# EAGLE design rapidshark-main-breakout-top-mk-1.0 (EAGLE 6.5.0)
AUTHOR: sean@yak.net
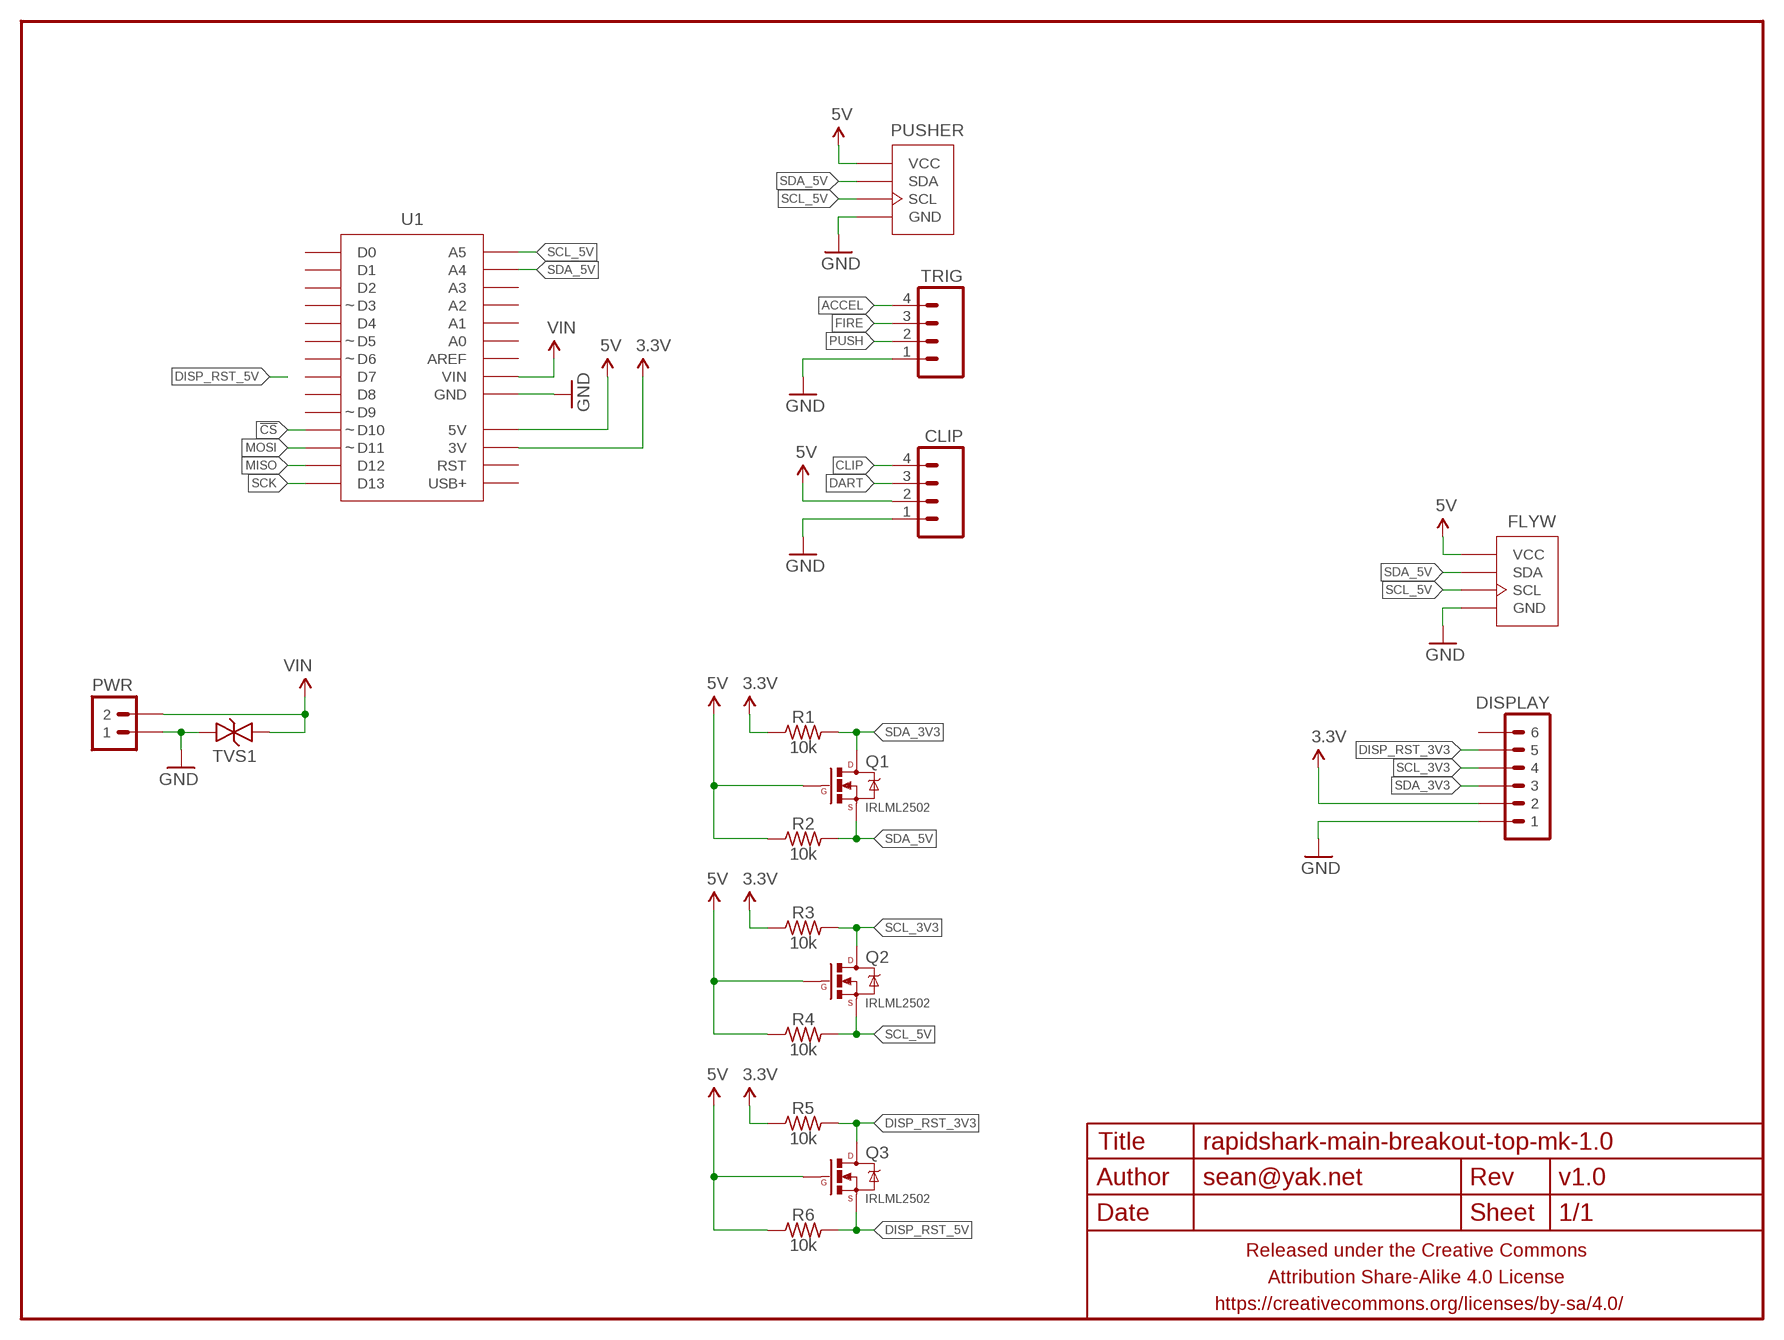
[diagram p0: schematic, sheet 1]

## Parts
CLIP  M04JST-PTH-VERT  [JST-4-PH-VERT-PTH]
DISPLAY  M06JST-PH-PTH-VERT  [JST-6-PH-VERT-PTH]
FLYW  M04-I2CJST-4-PH-VERT-NS  [JST-4-PH-VERT-PTH]
FRAME1  FRAME-LETTERNO_PACKAGE  [DUMMY]
PUSHER  M04-I2CJST-4-PH-VERT-NS  [JST-4-PH-VERT-PTH]
PWR  M02PTH-CENTERED-R+  [1X02-CENTER-R+]
Q1  IRLML2502  MOSFET-NCHANNELIRLML2502  [SOT23]
Q2  IRLML2502  MOSFET-NCHANNELIRLML2502  [SOT23]
Q3  IRLML2502  MOSFET-NCHANNELIRLML2502  [SOT23]
R1  10k  RESISTORR0603  [R0603]
R2  10k  RESISTORR0603  [R0603]
R3  10k  RESISTORR0603  [R0603]
R4  10k  RESISTORR0603  [R0603]
R5  10k  RESISTORR0603  [R0603]
R6  10k  RESISTORR0603  [R0603]
TRIG  M04JST-PTH-VERT  [JST-4-PH-VERT-PTH]
TVS1  TVSSMA  [SMA-DIODE-TVS-BIDIR]
U1  ADAFRUIT_METRO_MININOSILK-ABMBI  [ADAFRUIT_METRO_MINI_FLIPPED]

## Nets
3.3V: DISPLAY.2 R1.1 R3.1 R5.1 U1.17(3V)
5V: CLIP.2 FLYW.2(VCC) PUSHER.2(VCC) Q1.1(G) Q2.1(G) Q3.1(G) R2.1 R4.1 R6.1 U1.18(5V)
!CS: U1.11(D10)
ACCEL: TRIG.4
CLIP: CLIP.4
DART: CLIP.3
DISP_RST_3V3: DISPLAY.5 Q3.3(D) R5.2
DISP_RST_5V: Q3.2(S) R6.2
FIRE: TRIG.3
GND: CLIP.1 DISPLAY.1 FLYW.1(GND) PUSHER.1(GND) PWR.1 TRIG.1 TVS1.1 U1.19(GND) U1.20(GND)
MISO: U1.13(D12)
MOSI: U1.12(D11)
PUSH: TRIG.2
SCK: U1.14(D13)
SCL_3V3: DISPLAY.4 Q2.3(D) R3.2
SCL_5V: FLYW.4(SCL) PUSHER.4(SCL) Q2.2(S) R4.2 U1.28(A5)
SDA_3V3: DISPLAY.3 Q1.3(D) R1.2
SDA_5V: FLYW.3(SDA) PUSHER.3(SDA) Q1.2(S) R2.2 U1.27(A4)
VIN: PWR.2 TVS1.2 U1.21(VIN)
Unconnected: DISPLAY.6 U1.1(D0) U1.2(D1) U1.3(D2) U1.4(D3) U1.5(D4) U1.6(D5) U1.7(D6) U1.8(D7) U1.9(D8) U1.10(D9) U1.15(USB+) U1.16(RST) U1.22(AREF) U1.23(A0) U1.24(A1) U1.25(A2) U1.26(A3)

## Library data of the parts
CLIP TRIG = A_butts:M04: Header 4 Standard 4-pin 0.1" header. Use with straight break away headers (SKU : PRT-00116), right angle break away headers (PRT-00553), swiss pins (PRT-00743), machine pins (PRT-00117), and female headers (PRT-00115). Molex polarized connector foot print use with SKU : PRT-08231 with associated crimp pins and housings. 1MM SMD Version SKU: PRT-10208
DISPLAY = A_butts:M06: Header 6 Standard 6-pin 0.1" header. Use with straight break away headers (SKU : PRT-00116), right angle break away headers (PRT-00553), swiss pins (PRT-00743), machine pins (PRT-00117), and female headers (PRT-00115). Molex polarized connector foot print use with SKU : PRT-08094 with associated crimp pins and housings. NOTES ON THE VARIANTS LOCK and LOCK_LONGPADS... This footprint was designed to help hold the alignment of a through-hole component (i.e. 6-pin header) while soldering it into place. You may notice that each hole has been shifted either up or down by 0.005 of an inch from it's more standard position (which is a perfectly straight line). This slight alteration caused the pins (the squares in the middle) to touch the edges of the holes. Because they are alternating, it causes a "brace" to hold the component in place. 0.005 has proven to be the perfect amount of "off-center" position when using our standard breakaway headers. Although looks a little odd when you look at the bare footprint, once you have a header in there, the alteration is very hard to notice. Also,if you push a header all the way into place, it is covered up entirely on the bottom side. This idea of altering the position of holes to aid alignment will be further integrated into the Sparkfun Library for other footprints. It can help hold any component with 3 or more connection pins.
FLYW PUSHER = A_butts:M04-I2C
FRAME1 = A_butts:FRAME-LETTER: Schematic Frame Standard 8.5x11 US Letter frame; DESIGNER: sean@yak.net; VERSION: v1.0
PWR = A_butts:M02: Standard 2-pin 0.1" header. Use with - straight break away headers ( PRT-00116) - right angle break away headers (PRT-00553) - swiss pins (PRT-00743) - machine pins (PRT-00117) - female headers (PRT-00115) Molex polarized connector foot print use with: PRT-08233 with associated crimp pins and housings. 2.54_SCREWTERM for use with PRT-10571. 3.5mm Screw Terminal footprints for PRT-08084 5mm Screw Terminal footprints for use with PRT-08433
Q1-Q3 = A_butts:MOSFET-NCHANNEL: Common NMOSFET Parts MFG P/N Store ID Prod ID FDD8780 TRANS-09984 SI7820DN TRANS-11055 FDS6630A IC-08089 2N7002PW TRANS-11151 FQP30N06L COM-10213 TRANS-10060 BSS123LT1G TRANS-08345 BSS138 TRANS-00830 BS170 2N7000
R1-R6 = A_butts:RESISTOR: RESISTOR, American symbol
TVS1 = A_butts:TVS: Transient voltage suppressor- prevents ESD on inputs. Ignore package description- MBRA140 is NOT this type of part!!!
U1 = A_butts:ADAFRUIT_METRO_MINI

## Board
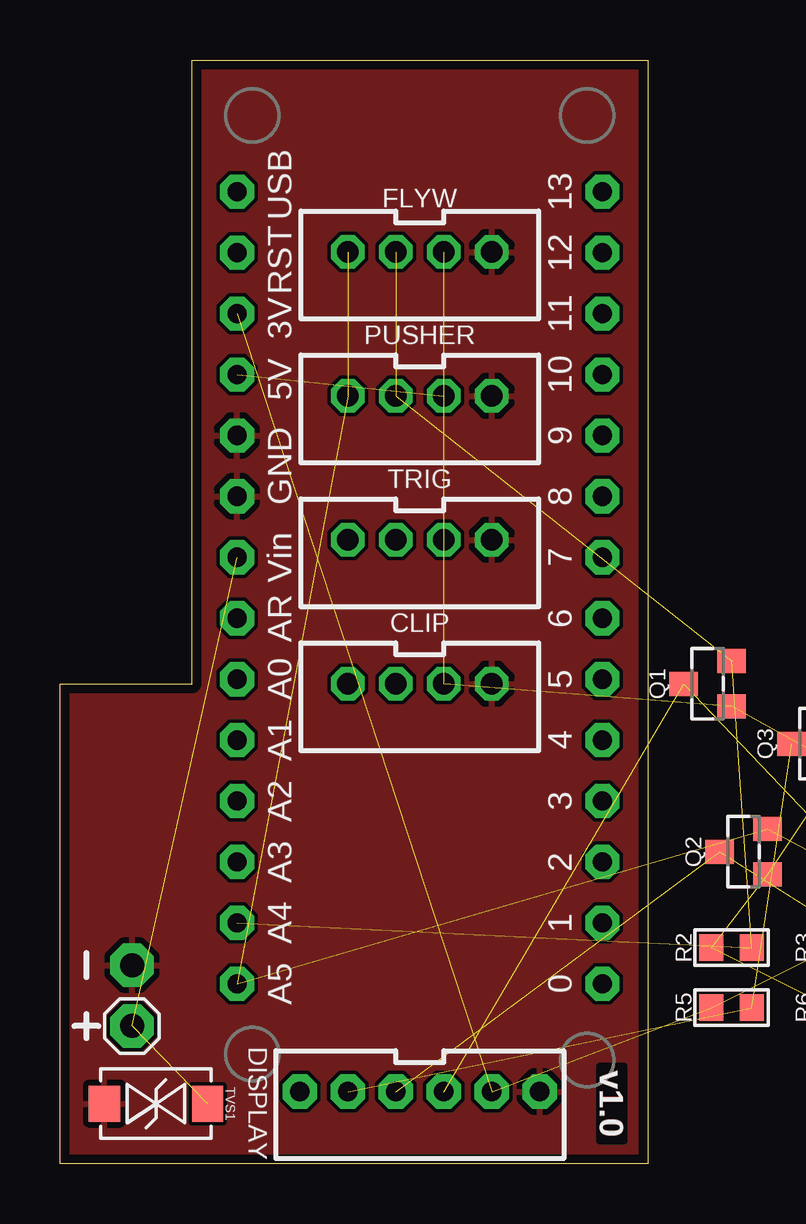
[diagram p1: board, top side]
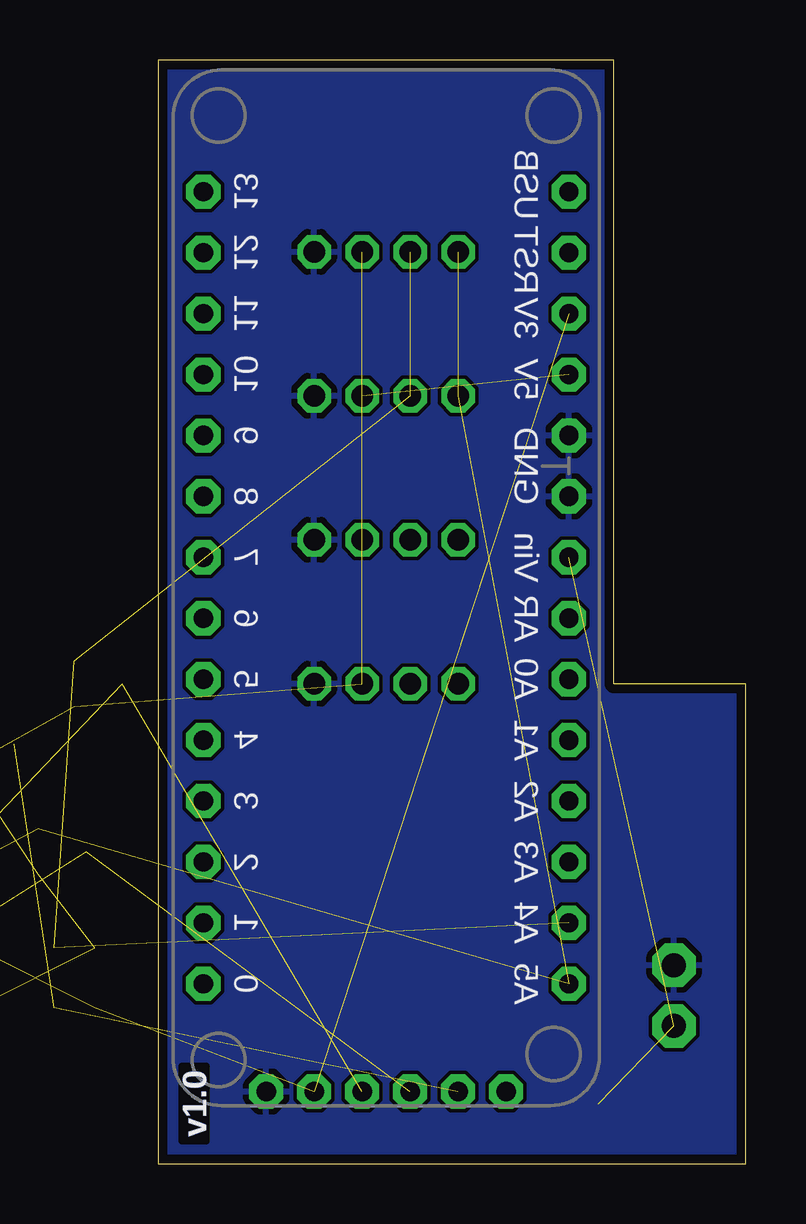
[diagram p2: board, bottom side, seen from below]

Size 24.5 x 46 mm. Coordinates in mm from the lower left corner, seen from the top.
Outline: 24.5,0 0,0 0,20 5.5,20 5.5,46 24.5,46 24.5,0
Copper layers (1*16): Top 0.0356mm / dielectric 1.5011mm / Bottom 0.0356mm
Design rules "LaenPCBOrder_2": minimum track width 6mil, minimum drill 13mil, track to track 6mil, track to pad 6mil, pad to pad 6mil, via to via 6mil, smd to smd 6mil, copper to edge 15mil, drill to drill 6mil, minimum pad ring 7mil, minimum via ring 7mil, stop-mask expansion 3mil, vias tented up to drill 20mil, thermal gap 10mil

### Footprints (pad centres in the part's own frame; a part is rotated, then mirrored left to right if it is on the bottom)
JST-4-PH-VERT-PTH = drill 0.9 pad 1.4 octagon: 1 0,0; 2 2,0; 3 4,0; 4 6,0
JST-6-PH-VERT-PTH = drill 0.8 pad 1.422 octagon: 1 -5,0; 2 -3,0; 3 -1,0; 4 1,0; 5 3,0; 6 5,0
1X02-CENTER-R+ = drill 1 pad 1.8 octagon: 1 -1.27,0; 2 1.27,0
SOT23 = smd 1 x 1.2: 1 -0.95,-1; 2 0.95,-1; 3 0,1
R0603 = smd 1 x 1.1: 1 -0.85,0; 2 0.85,0
SMA-DIODE-TVS-BIDIR = smd 1.3 x 1.5: 1 -2.15,0; 2 2.15,0
ADAFRUIT_METRO_MINI_FLIPPED = drill 0.8 pad 1.422 octagon: 1 16.51,7.62; 2 13.97,7.62; 3 11.43,7.62; 4 8.89,7.62; 5 6.35,7.62; 6 3.81,7.62; 7 1.27,7.62; 8 -1.27,7.62; 9 -3.81,7.62; 10 -6.35,7.62; 11 -8.89,7.62; 12 -11.43,7.62; 13 -13.97,7.62; 14 -16.51,7.62; 15 -16.51,-7.62; 16 -13.97,-7.62; 17 -11.43,-7.62; 18 -8.89,-7.62; 19 -6.35,-7.62; 20 -3.81,-7.62; 21 -1.27,-7.62; 22 1.27,-7.62; 23 3.81,-7.62; 24 6.35,-7.62; 25 8.89,-7.62; 26 11.43,-7.62; 27 13.97,-7.62; 28 16.51,-7.62

### Placement (x,y rotation side)
CLIP  18,20 180 top
DISPLAY  15,3 180 top
FLYW  18,38 180 top
FRAME1  0,0 0 bottom
PUSHER  18,32 180 top
PWR  3,7 270 top
Q1  27,20 90 top
Q2  28.5,13 90 top
Q3  31.5,17.5 90 top  (outside the outline)
R1  38,6.5 0 top  (outside the outline)
R2  28,9 0 top
R3  33,9 0 top  (outside the outline)
R4  38,9 0 top  (outside the outline)
R5  28,6.5 0 top
R6  33,6.5 0 top  (outside the outline)
TRIG  18,26 180 top
TVS1  4,2.5 0 top
U1  15,24 270 top

### Tracks (layer width: path | path; a pad name or v marks a point on that pad's centre or on a via)
3.3V  (4 unrouted)
5V  (9 unrouted)
DISP_RST_3V3  (2 unrouted)
DISP_RST_5V  (1 unrouted)
GND
  pour Top (rank 6): 0,0 0,20 5.5,20 5.5,46 24.5,46 24.5,0
  pour Bottom (rank 6): 0,0 0,20 5.5,20 5.5,46 24.5,46 24.5,0
SCL_3V3  (2 unrouted)
SCL_5V  (4 unrouted)
SDA_3V3  (2 unrouted)
SDA_5V  (4 unrouted)
VIN  (2 unrouted)

### Text on the board
Top: TOP layer faces / LEFT of blaster
Bottom: BOTTOM layer faces / RIGHT of blaster
Reference: BARREL | DOWN | UP | BUTT
tDocu: TOP layer faces / LEFT of blaster
bDocu: BOTTOM layer faces / RIGHT of blaster